# EAGLE design RGB_i2c_LED_v2 (EAGLE 7.3.0)
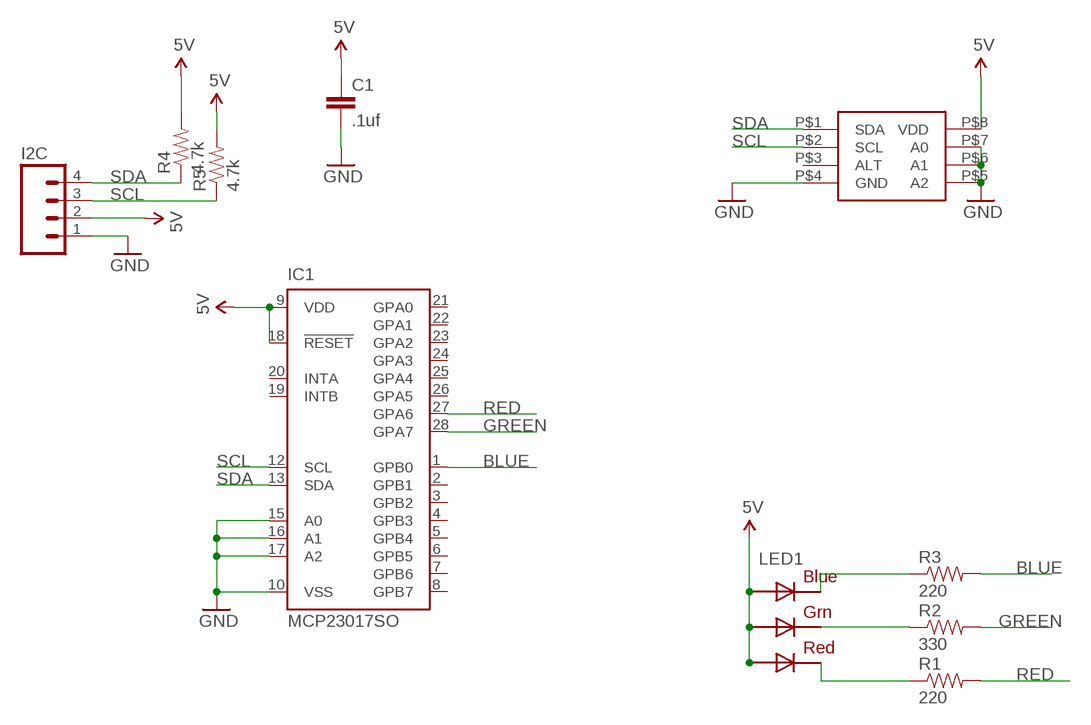
[diagram p0: schematic, sheet 1]

## Parts
C1  .1uf  CAP0805  [0805]
I2C  M04LOCK  [1X04_LOCK]
IC1  MCP23017SO  [SO28W]
IC2  MCP9808  [MSOP8]
LED1  RGBLED5050  [RGBLED5050]
R1  220  RESISTOR0805-RES  [0805]
R2  330  RESISTOR0805-RES  [0805]
R3  220  RESISTOR0805-RES  [0805]
R4  4.7k  RESISTOR0805-RES  [0805]
R5  4.7k  RESISTOR0805-RES  [0805]

## Nets
5V: C1.1 I2C.2 IC1.9(VDD) IC1.18(!RESET) IC2.P$8(VDD) LED1.4(GREEN_A) LED1.5(RED_A) LED1.6(BLUE_A) R4.2 R5.2
BLUE: IC1.1(GPB0) R3.2
GND: C1.2 I2C.1 IC1.10(VSS) IC1.15(A0) IC1.16(A1) IC1.17(A2) IC2.P$4(GND) IC2.P$5(A2) IC2.P$6(A1) IC2.P$7(A0)
GREEN: IC1.28(GPA7) R2.2
N$1: LED1.1(GREEN_C) R2.1
N$2: LED1.2(RED_C) R1.1
N$3: LED1.3(BLUE_C) R3.1
RED: IC1.27(GPA6) R1.2
SCL: I2C.3 IC1.12(SCL) IC2.P$2(SCL) R5.1
SDA: I2C.4 IC1.13(SDA) IC2.P$1(SDA) R4.1
Unconnected: IC1.2(GPB1) IC1.3(GPB2) IC1.4(GPB3) IC1.5(GPB4) IC1.6(GPB5) IC1.7(GPB6) IC1.8(GPB7) IC1.19(INTB) IC1.20(INTA) IC1.21(GPA0) IC1.22(GPA1) IC1.23(GPA2) IC1.24(GPA3) IC1.25(GPA4) IC1.26(GPA5) IC2.P$3(ALT)

## Library data of the parts
C1 = SparkFun:CAP: Capacitor Standard 0603 ceramic capacitor, and 0.1" leaded capacitor.
I2C = SparkFun:M04: Header 4 Standard 4-pin 0.1" header. Use with straight break away headers (SKU : PRT-00116), right angle break away headers (PRT-00553), swiss pins (PRT-00743), machine pins (PRT-00117), and female headers (PRT-00115). Molex polarized connector foot print use with SKU : PRT-08231 with associated crimp pins and housings. 1MM SMD Version SKU: PRT-10208
IC1 = adafruit:MCP23017: http://ww1.microchip.com/downloads/en/DeviceDoc/21952a.pdf Source: http://ww1.microchip.com/downloads/en/DeviceDoc/21952a.pdf
IC2 = Qxd:MCP9808
LED1 = adafruit:RGBLED: For 5050 RGB LEDs, the order of the LEDs may vary from one manufacturer to another!
R1-R5 = SparkFun:RESISTOR: Resistor Basic schematic elements and footprints for 0603, 1206, and PTH resistors.

## Board
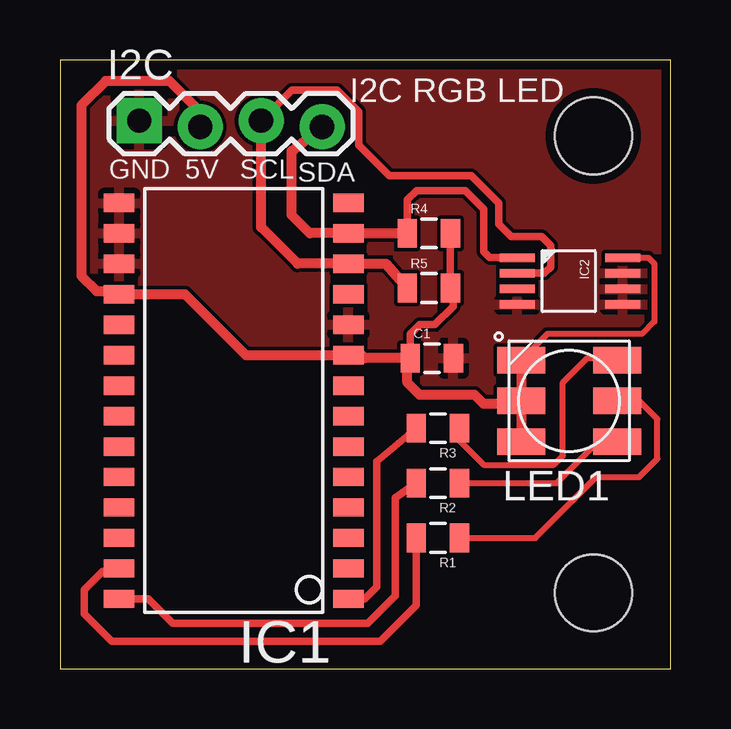
[diagram p1: board, top side]
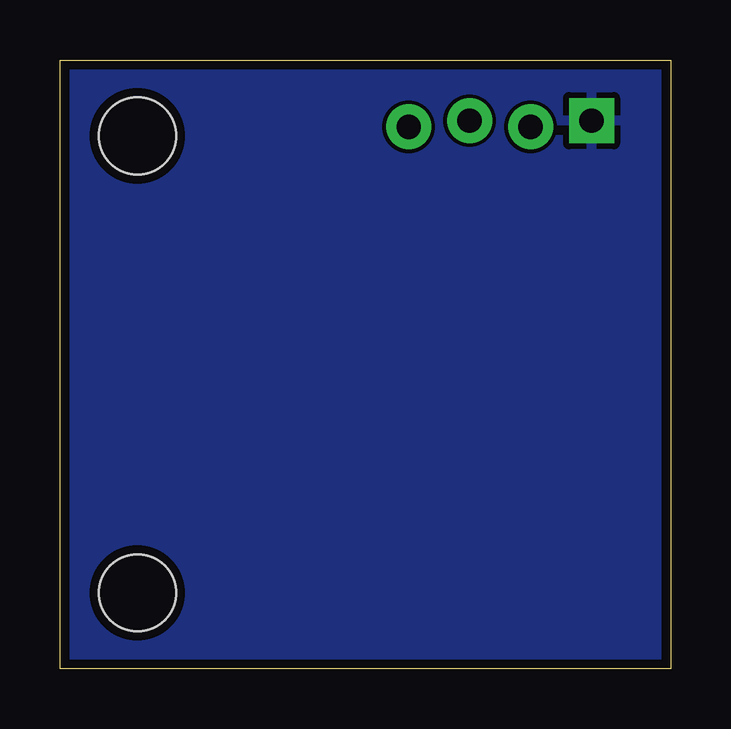
[diagram p2: board, bottom side, seen from below]

Size 25.45 x 25.39 mm. Coordinates in mm from the lower left corner, seen from the top.
Outline: 0,0 25.45,0 25.45,25.39 0,25.39 0,0
Copper layers (1*16): Top 0.0356mm / dielectric 1.5011mm / Bottom 0.0356mm
Design rules "default": minimum track width 6mil, minimum drill 13mil, track to track 6mil, track to pad 6mil, pad to pad 6mil, via to via 6mil, smd to smd 6mil, copper to edge 15mil, drill to drill 6mil, minimum pad ring 7mil, minimum via ring 7mil, stop-mask expansion 4mil, vias tented up to drill 0mil, thermal gap 10mil
Holes 3.2 mm at 22.23,22.23 22.23,3.17

### Footprints (pad centres in the part's own frame; a part is rotated, then mirrored left to right if it is on the bottom)
0805 = smd 0.8 x 1.2: 1 -0.9,0; 2 0.9,0
1X04_LOCK = drill 1.016 pad 1.88 square: 1 0,0.127 | drill 1.016 pad 1.88: 2 2.54,-0.127; 3 5.08,0.127; 4 7.62,-0.127
SO28W = smd 0.762 x 1.27: 1 -7.62,-4.78; 2 -6.35,-4.78; 3 -5.08,-4.78; 4 -3.81,-4.78; 5 -2.54,-4.78; 6 -1.27,-4.78; 7 0,-4.78; 8 1.27,-4.78; 9 2.54,-4.78; 10 3.81,-4.78; 11 5.08,-4.78; 12 6.35,-4.78; 13 7.62,-4.78; 14 8.89,-4.78; 15 8.89,4.78; 16 7.62,4.78; 17 6.35,4.78; 18 5.08,4.78; 19 3.81,4.78; 20 2.54,4.78; 21 1.27,4.78; 22 0,4.78; 23 -1.27,4.78; 24 -2.54,4.78; 25 -3.81,4.78; 26 -5.08,4.78; 27 -6.35,4.78; 28 -7.62,4.78
MSOP8 = smd 0.35 x 1.45: P$1 0,0; P$2 0.65,0; P$3 1.3,0; P$4 1.95,0; P$5 1.95,4.4; P$6 1.3,4.4; P$7 0.65,4.4; P$8 0,4.4
RGBLED5050 = smd 2 x 1.1: 1 -2,1.7; 2 -2,0; 3 -2,-1.7; 4 2,-1.7; 5 2,0; 6 2,1.7

### Placement (x,y rotation side)
C1  15.49,12.95 0 top
I2C  3.3,22.73 0 top
IC1  7.24,10.54 90 top
IC2  19.05,17.14 270 top
LED1  21.21,11.18 180 top
R1  15.75,5.46 180 top
R2  15.75,7.75 180 top
R3  15.75,10.03 180 top
R4  15.37,18.16 0 top
R5  15.37,15.88 0 top

### Tracks (layer width: path | path; a pad name or v marks a point on that pad's centre or on a via)
5V
  Top 0.254: 12.15,12.95 IC1.9 | IC2.P$8 24.51,17.14 24.77,16.89 24.77,14.48 24.26,13.97 20.3,13.97 LED1.4
  Top 0.305: LED1.4 19.21,11.21 19.05,11.05 | R4.2 R5.2 16.38,15.86 16.38,15.11 15.62,14.35 14.99,14.35 14.59,13.96 C1.1
  Top 0.406: 12.7,12.95 C1.1 14.48,12.84 14.48,11.94 14.99,11.43 17.27,11.43 17.65,11.05 19.05,11.05 | 12.7,12.95 12.15,12.95 | LED1.4 LED1.5 LED1.6 | 12.7,12.95 12.57,13.08 7.75,13.08 5.21,15.62 IC1.18 2.33,15.75 1.52,15.75 0.89,16.38 0.89,23.5 1.91,24.51 4.57,24.51 5.84,23.24 I2C.2
BLUE
  Top 0.305: IC1.1 12.7,2.92 13.21,3.43 13.21,8.65 R3.2
GND
  pour Top: -9.4,-9.4 34.16,-8.26 34.67,34.04 -8.89,32.89
  pour Bottom: -6.35,-5.84 31.37,-5.59 30.73,31.11 -6.99,30.86
GREEN
  Top 0.305: IC1.28 3.68,2.92 4.7,1.91 12.83,1.91 13.97,3.05 13.97,7.12 R2.2
N$1
  Top 0.254: R2.1 20.7,7.75 22.23,9.27 23,9.27 LED1.1
N$2
  Top 0.254: R1.1 19.81,5.46 22.35,8 24.13,8 24.89,8.76 24.89,10.41 24.13,11.18 LED1.2
N$3
  Top 0.254: R3.1 16.39,9.77 17.65,8.51 20.57,8.51 20.95,8.89 20.95,11.94 21.97,12.95 23.13,12.95 LED1.3
RED
  Top 0.305: R1.2 14.85,2.66 13.34,1.14 2.16,1.14 1.02,2.29 1.02,3.3 1.78,4.06 2.33,4.06 IC1.27
SCL
  Top 0.305: IC2.P$2 20.18,16.5 20.45,16.76 20.45,17.65 20.07,18.03 18.8,18.03 18.29,18.54 18.29,19.43 17.14,20.57 13.72,20.57 12.45,21.84 12.45,23.24 11.56,24.13 9.65,24.13 I2C.3
  Top 0.406: I2C.3 8.38,18.41 9.91,16.89 IC1.12 13.58,16.89 R5.1
SDA
  Top 0.305: IC2.P$1 17.91,17.14 17.65,17.4 17.65,19.18 16.89,19.94 14.86,19.94 14.48,19.56 14.48,18.66 R4.1
  Top 0.406: I2C.4 9.65,21.59 9.65,18.92 10.41,18.16 IC1.13 R4.1

### Text on the board
tNames: I2C RGB LED | GND | 5V | SCL | SDA